# EAGLE design isp_hvp_shield (EAGLE 7.2.0)
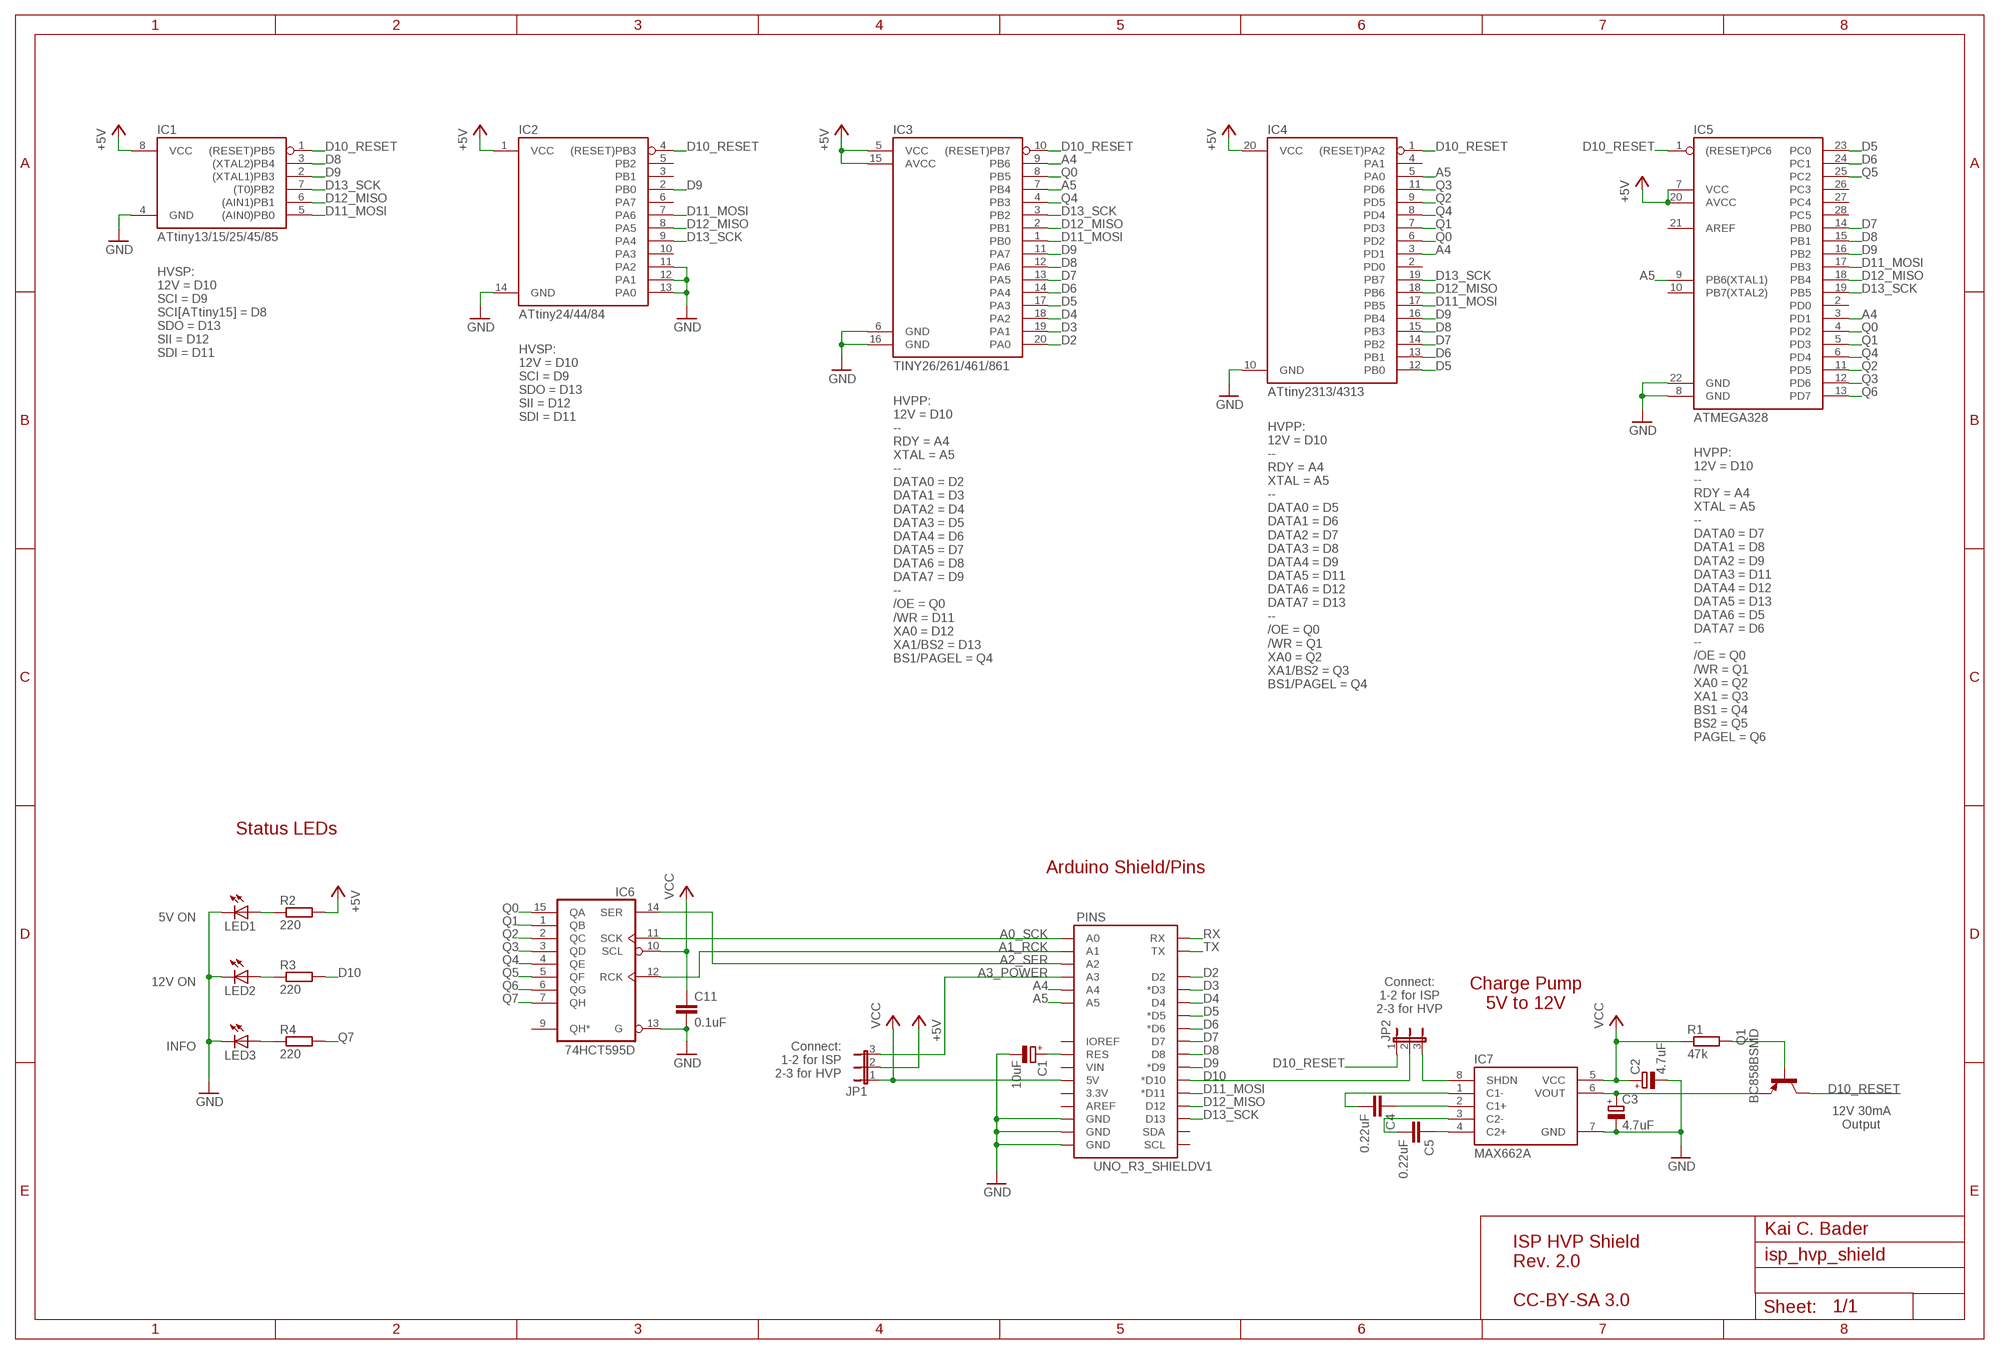
[diagram p0: schematic, sheet 1]

## Parts
C1  10uF  CPOL-EUE2-5  [E2-5]
C2  4.7uF  CPOL-EUE2-5  [E2-5]
C3  4.7uF  CPOL-EUE2-5  [E2-5]
C4  0.22uF  C-EUC0805  [C0805]
C5  0.22uF  C-EUC0805  [C0805]
C11  0.1uF  C-EUC0805  [C0805]
IC1  ATtiny13/15/25/45/85  TINY85P  [DIL08]
IC2  ATtiny24/44/84  TINY84  [DIL14]
IC3  TINY26/261/461/861  TINY26  [DIL20]
IC4  ATtiny2313/4313  TINY2313  [DIL20]
IC5  ATMEGA328  [DIL28]
IC6  74HCT595D  [SO16]
IC7  MAX662A  [SO08]
JP1  JP2E  [JP2]
JP2  JP2E  [JP2]
LED1  LEDCHIPLED_0805  [CHIPLED_0805]
LED2  LEDCHIPLED_0805  [CHIPLED_0805]
LED3  LEDCHIPLED_0805  [CHIPLED_0805]
PINS  UNO_R3_SHIELDV1  [UNO_R3_SHIELD]
Q1  BC858BSMD  [SOT23-BEC]
R1  47k  R-EU_R0805  [R0805]
R2  220  R-EU_R0805  [R0805]
R3  220  R-EU_R0805  [R0805]
R4  220  R-EU_R0805  [R0805]

## Nets
220: LED2.A R3.1
+5V: IC1.8(VCC) IC2.1(VCC) IC3.5(VCC) IC3.15(AVCC) IC4.20(VCC) IC5.7(VCC) IC5.20(AVCC) JP1.2 R2.2
A0_SCK: IC6.11(SCK) PINS.A0
A1_RCK: IC6.12(RCK) PINS.A1
A2_SER: IC6.14(SER) PINS.A2
A3_POWER: JP1.3 PINS.A3
A4: IC3.9(PB6) IC4.3(PD1) IC5.3(PD1) PINS.A4
A5: IC3.7(PB4) IC4.5(PA0) IC5.9(PB6(XTAL1)) PINS.A5
D2: IC3.20(PA0) PINS.D2
D3: IC3.19(PA1) PINS.D3(*D3)
D4: IC3.18(PA2) PINS.D4
D5: IC3.17(PA3) IC4.12(PB0) IC5.23(PC0) PINS.D5(*D5)
D6: IC3.14(PA4) IC4.13(PB1) IC5.24(PC1) PINS.D6(*D6)
D7: IC3.13(PA5) IC4.14(PB2) IC5.14(PB0) PINS.D7
D8: IC1.3((XTAL2)PB4) IC3.12(PA6) IC4.15(PB3) IC5.15(PB1) PINS.D8
D9: IC1.2((XTAL1)PB3) IC2.2(PB0) IC3.11(PA7) IC4.16(PB4) IC5.16(PB2) PINS.D9(*D9)
D10: JP2.2 PINS.D10(*D10) R3.2
D10_RESET: IC1.1((RESET)PB5) IC2.4((RESET)PB3) IC3.10((RESET)PB7) IC4.1((RESET)PA2) IC5.1((RESET)PC6) JP2.1 Q1.C
D11_MOSI: IC1.5((AIN0)PB0) IC2.7(PA6) IC3.1(PB0) IC4.17(PB5) IC5.17(PB3) PINS.D11(*D11)
D12_MISO: IC1.6((AIN1)PB1) IC2.8(PA5) IC3.2(PB1) IC4.18(PB6) IC5.18(PB4) PINS.D12
D13_SCK: IC1.7((T0)PB2) IC2.9(PA4) IC3.3(PB2) IC4.19(PB7) IC5.19(PB5) PINS.D13
GND: C1.- C2.- C3.- C11.2 IC1.4(GND) IC2.11(PA2) IC2.12(PA1) IC2.13(PA0) IC2.14(GND) IC3.6(GND) IC3.16(GND) IC4.10(GND) IC5.8(GND) IC5.22(GND) IC6.13(G) IC7.7(GND) LED1.C LED2.C LED3.C PINS.GND@0(GND) PINS.GND@1(GND) PINS.GND@2(GND)
N$1: IC7.8(SHDN) JP2.3
N$2: C1.+ PINS.RES
N$3: Q1.B R1.2
N$4: C5.1 IC7.4(C2+)
N$5: C5.2 IC7.3(C2-)
N$6: C4.1 IC7.2(C1+)
N$7: C4.2 IC7.1(C1-)
N$8: LED1.A R2.1
N$10: LED3.A R4.1
Q0: IC3.8(PB5) IC4.6(PD2) IC5.4(PD2) IC6.15(QA)
Q1: IC4.7(PD3) IC5.5(PD3) IC6.1(QB)
Q2: IC4.9(PD5) IC5.11(PD5) IC6.2(QC)
Q3: IC4.11(PD6) IC5.12(PD6) IC6.3(QD)
Q4: IC3.4(PB3) IC4.8(PD4) IC5.6(PD4) IC6.4(QE)
Q5: IC5.25(PC2) IC6.5(QF)
Q6: IC5.13(PD7) IC6.6(QG)
Q7: IC6.7(QH) R4.2
RX: PINS.RX
TX: PINS.TX
VCC: C2.+ C11.1 IC6.10(SCL) IC7.5(VCC) JP1.1 PINS.5V R1.1
VOUT: C3.+ IC7.6(VOUT) Q1.E
Unconnected: IC2.3(PB1) IC2.5(PB2) IC2.6(PA7) IC2.10(PA3) IC4.2(PD0) IC4.4(PA1) IC5.2(PD0) IC5.10(PB7(XTAL2)) IC5.26(PC3) IC5.27(PC4) IC5.28(PC5) IC6.9(QH*) PINS.3.3V PINS.AREF PINS.IOREF PINS.SCL PINS.SDA PINS.VIN

## Notes on the sheet
- HVSP:
  12V = D10
  SCI = D9
  SCI[ATtiny15] = D8
  SDO = D13
  SII = D12
  SDI = D11
- HVSP:
  12V = D10
  SCI = D9
  SDO = D13
  SII = D12
  SDI = D11
- HVPP:
  12V = D10
  --
  RDY = A4
  XTAL = A5
  --
  DATA0 = D2
  DATA1 = D3
  DATA2 = D4
  DATA3 = D5
  DATA4 = D6
  DATA5 = D7
  DATA6 = D8
  DATA7 = D9
  --
  /OE = Q0
  /WR = D11
  XA0 = D12
  XA1/BS2 = D13
  BS1/PAGEL = Q4
- HVPP:
  12V = D10
  --
  RDY = A4
  XTAL = A5
  --
  DATA0 = D5
  DATA1 = D6
  DATA2 = D7
  DATA3 = D8
  DATA4 = D9
  DATA5 = D11
  DATA6 = D12
  DATA7 = D13
  --
  /OE = Q0
  /WR = Q1
  XA0 = Q2
  XA1/BS2 = Q3
  BS1/PAGEL = Q4
- HVPP:
  12V = D10
  --
  RDY = A4
  XTAL = A5
  --
  DATA0 = D7
  DATA1 = D8
  DATA2 = D9
  DATA3 = D11
  DATA4 = D12
  DATA5 = D13
  DATA6 = D5
  DATA7 = D6
  --
  /OE = Q0
  /WR = Q1
  XA0 = Q2
  XA1 = Q3
  BS1 = Q4
  BS2 = Q5
  PAGEL = Q6
- Status LEDs
- Arduino Shield/Pins
- 5V ON
- 12V ON
- Connect:
  1-2 for ISP
  2-3 for HVP
- Charge Pump
  5V to 12V
- INFO
- Connect:
  1-2 for ISP
  2-3 for HVP
- 12V 30mA
  Output
- Kai C. Bader
- ISP HVP Shield
  Rev. 2.0
  
  CC-BY-SA 3.0

## Power pins joined to a net without a drawn wire
AREF: IC5.21(AREF)
GND: IC6.8(GND)
VCC: IC6.16(VCC)

## Library data of the parts
C1-C3 = rcl:CPOL-EU: POLARIZED CAPACITOR, European symbol
C4 C5 C11 = rcl:C-EU: CAPACITOR, European symbol
IC1 = kaibader:TINY85: ATtiny85 8-bit AVR Microcontroller, 8KB Flash Pin-compatible to ATtiny25, ATtiny45; OC_FARNELL: unknown; OC_NEWARK: unknown
IC2 = kaibader:TINY84: ATtiny84 8-bit AVR Microcontroller, 8KB Flash Pin-compatible to ATtiny24, ATtiny44
IC3 = kaibader:TINY26: ATtiny26
IC4 = kaibader:TINY2313: ATtiny2313 8-bit AVR Microcontroller, 2KB Flash Pin-compatible to ATtiny4313
IC5 = kaibader:ATMEGA328: ATmega328P
IC6 = 74xx-eu:74*595: 8-bit SHIFT REGISTER, output latch
IC7 = kaibader:MAX662A: MAX662A / ST662A MAXIM +12V, 30mA Flash Memory Programming Supply
JP1 JP2 = jumper:JP2E: JUMPER
LED1-LED3 = led:LED: LED OSRAM: - CHIPLED LG R971, LG N971, LY N971, LG Q971, LY Q971, LO R971, LY R971 LH N974, LH R974 LS Q976, LO Q976, LY Q976 LO Q996 - Hyper CHIPLED LW Q18S LB Q993, LB Q99A, LB R99A - SideLED LS A670, LO A670, LY A670, LG A670, LP A670 LB A673, LV A673, LT A673, LW A673 LH A674 LY A675 LS A676, LA A676, LO A676, LY A676, LW A676 LS A679, LY A679, LG A679 - Hyper Micro SIDELED® LS Y876, LA Y876, LO Y876, LY Y876 LT Y87S - SmartLED LW L88C, LW L88S LB L89C, LB L89S, LG L890 LS L89K, LO L89K, LY L89K LS L896, LA L896, LO L896, LY L896 - TOPLED LS T670, LO T670, LY T670, LG T670, LP T670 LSG T670, LSP T670, LSY T670, LOP T670, LYG T670 LG T671, LOG T671, LSG T671 LB T673, LV T673, LT T673, LW T673 LH T674 LS T676, LA T676, LO T676, LY T676, LB T676, LH T676, LSB T676, LW T676 LB T67C, LV T67C, LT T67C, LS T67K, LO T67K, LY T67K, LW E67C LS E67B, LA E67B, LO E67B, LY E67B, LB E67C, LV E67C, LT E67C LW T67C LS T679, LY T679, LG T679 LS T770, LO T770, LY T770, LG T770, LP T770 LB T773, LV T773, LT T773, LW T773 LH T774 LS E675, LA E675, LY E675, LS T675 LS T776, LA T776, LO T776, LY T776, LB T776 LHGB T686 LT T68C, LB T68C - Hyper Mini TOPLED® LB M676 - Mini TOPLED Santana® LG M470 LS M47K, LO M47K, LY M47K Source: http://www.osram.convergy.de LUXEON: - LUMILED® LXK2-PW12-R00, LXK2-PW12-S00, LXK2-PW14-U00, LXK2-PW14-V00 LXK2-PM12-R00, LXK2-PM12-S00, LXK2-PM14-U00 LXK2-PE12-Q00, LXK2-PE12-R00, LXK2-PE12-S00, LXK2-PE14-T00, LXK2-PE14-U00 LXK2-PB12-K00, LXK2-PB12-L00, LXK2-PB12-M00, LXK2-PB14-N00, LXK2-PB14-P00, LXK2-PB14-Q00 LXK2-PR12-L00, LXK2-PR12-M00, LXK2-PR14-Q00, LXK2-PR14-R00 LXK2-PD12-Q00, LXK2-PD12-R00, LXK2-PD12-S00 LXK2-PH12-R00, LXK2-PH12-S00 LXK2-PL12-P00, LXK2-PL12-Q00, LXK2-PL12-R00 Source: www.luxeon.com KINGBRIGHT: KA-3528ASYC Source: www.kingbright.com
PINS = kaibader:UNO_R3_SHIELD: Shield form compatible with the Arduino Uno R3.
Q1 = transistor-pnp:BC858*: PNP Transistror
R1-R4 = rcl:R-EU_: RESISTOR, European symbol

## Board
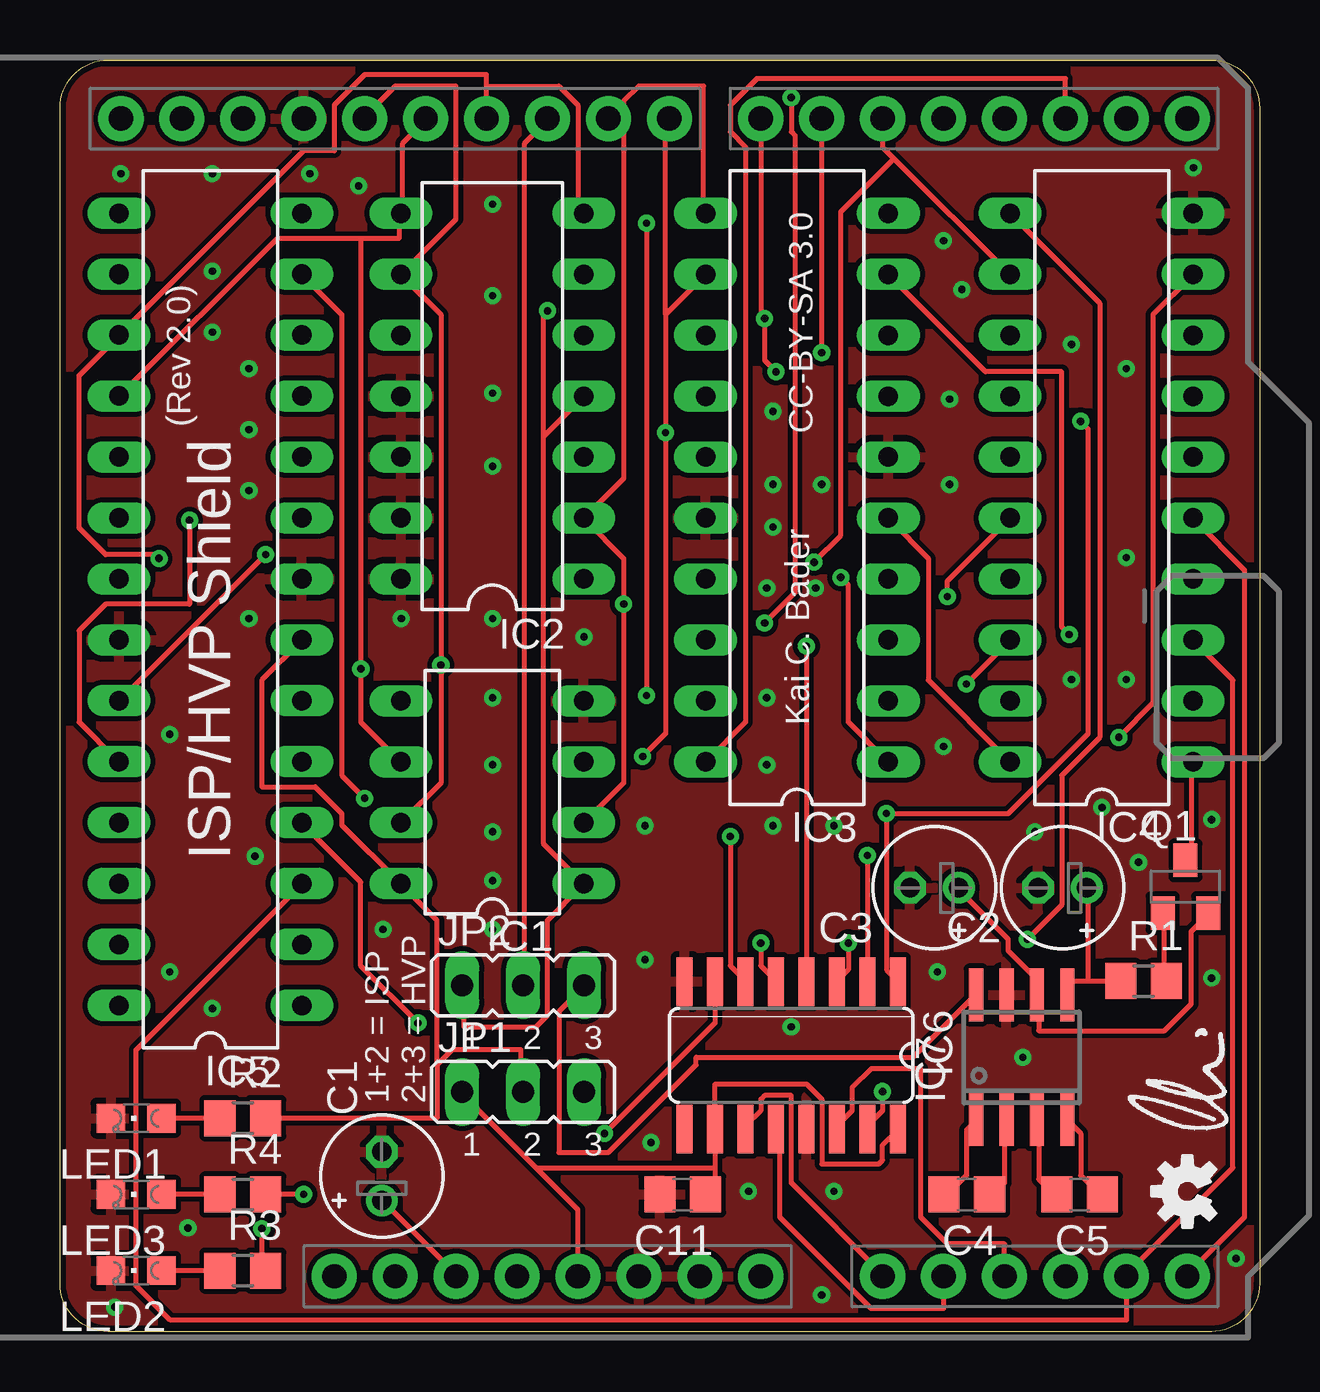
[diagram p1: board, top side]
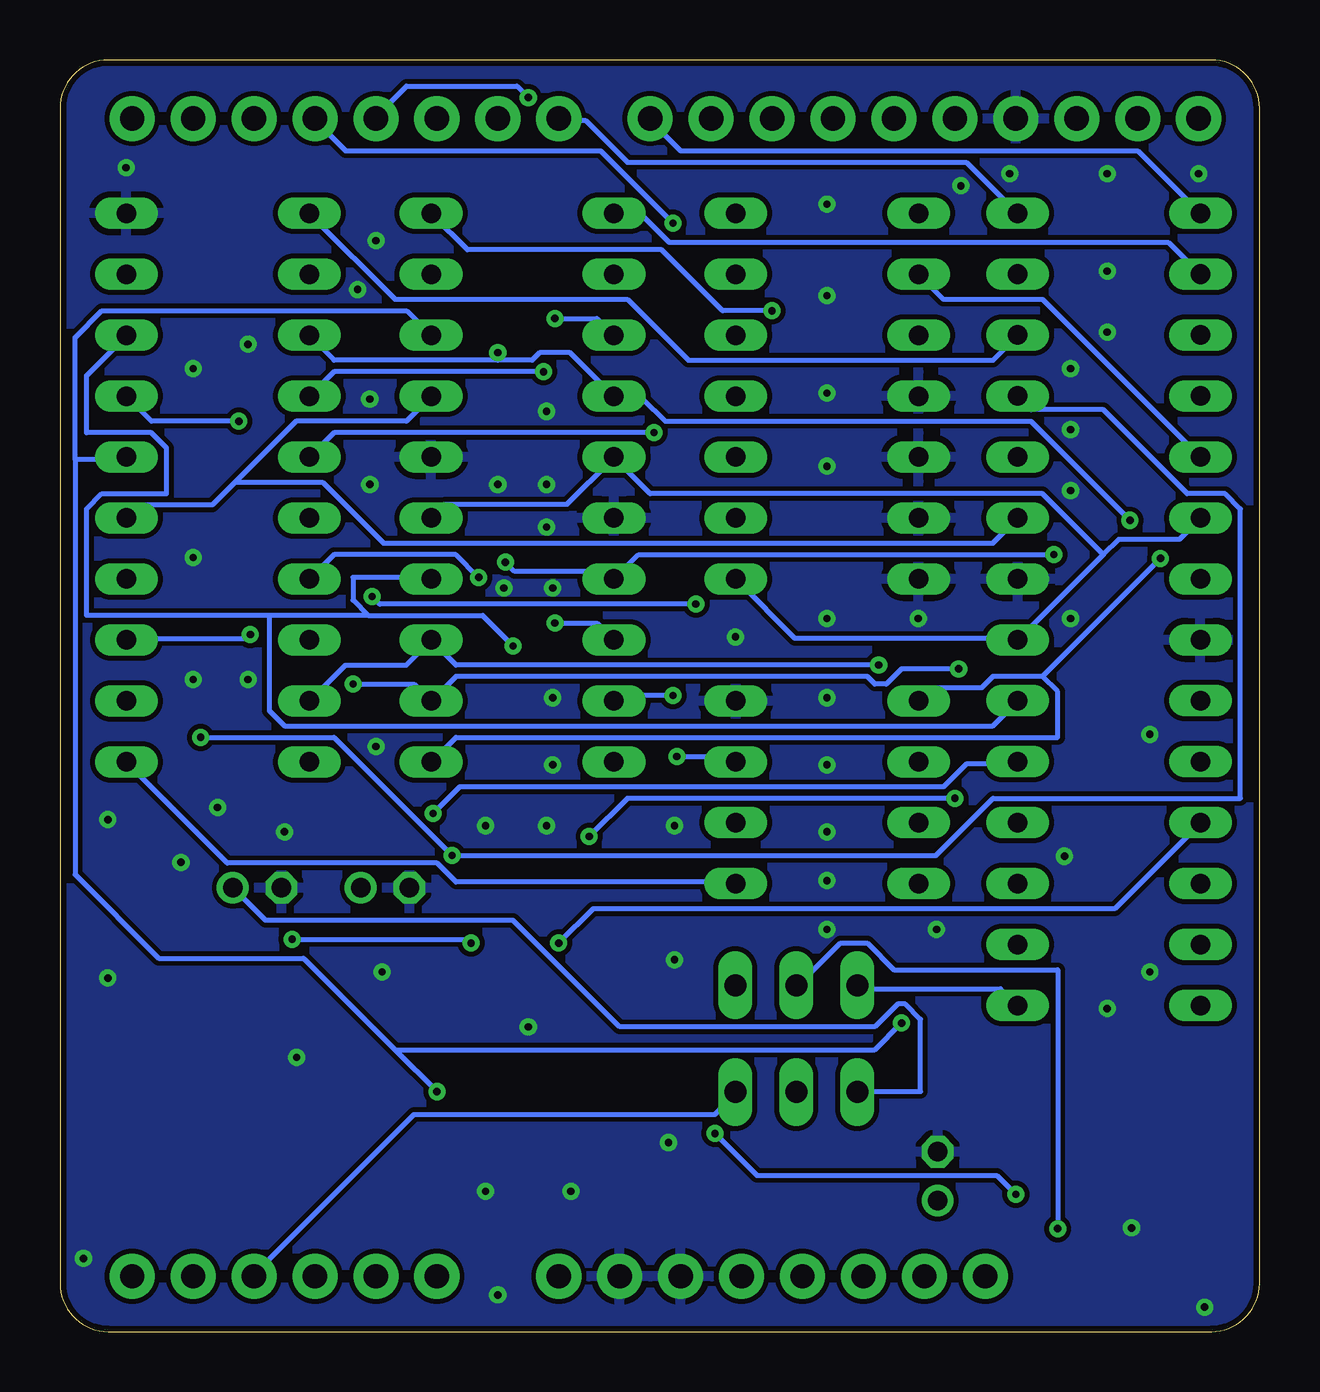
[diagram p2: board, bottom side, seen from below]

Size 50 x 53 mm. Coordinates in mm from the lower left corner, seen from the top.
Outline: 0,2 0,51 arc-90 2,53 48,53 arc-90 50,51 50,2 arc-90 48,0 2,0 arc-90 0,2
Copper layers (1*16): Top 0.035mm / dielectric 1.5mm / Bottom 0.035mm
Design rules "ITEADstudio_DRC *": minimum track width 8mil, minimum drill 12mil, track to track 8mil, track to pad 8mil, pad to pad 8mil, via to via 8mil, smd to smd 0mil, copper to edge 10mil, drill to drill 10mil, minimum pad ring 10mil, minimum via ring 8mil, stop-mask expansion 2mil, vias tented up to drill 100mil, thermal gap 10mil

### Footprints (pad centres in the part's own frame; a part is rotated, then mirrored left to right if it is on the bottom)
E2-5 = drill 0.813 pad 1.27: + -1.016,0 | drill 0.813 pad 1.27 octagon: - 1.016,0
C0805 = smd 1.3 x 1.5: 1 -0.95,0; 2 0.95,0
DIL08 = drill 0.813 long: 1 -3.81,-3.81; 2 -1.27,-3.81; 3 1.27,-3.81; 4 3.81,-3.81; 5 3.81,3.81; 6 1.27,3.81; 7 -1.27,3.81; 8 -3.81,3.81
DIL14 = drill 0.813 long: 1 -7.62,-3.81; 2 -5.08,-3.81; 3 -2.54,-3.81; 4 0,-3.81; 5 2.54,-3.81; 6 5.08,-3.81; 7 7.62,-3.81; 8 7.62,3.81; 9 5.08,3.81; 10 2.54,3.81; 11 0,3.81; 12 -2.54,3.81; 13 -5.08,3.81; 14 -7.62,3.81
DIL20 = drill 0.813 long: 1 -11.43,-3.81; 2 -8.89,-3.81; 3 -6.35,-3.81; 4 -3.81,-3.81; 5 -1.27,-3.81; 6 1.27,-3.81; 7 3.81,-3.81; 8 6.35,-3.81; 9 8.89,-3.81; 10 11.43,-3.81; 11 11.43,3.81; 12 8.89,3.81; 13 6.35,3.81; 14 3.81,3.81; 15 1.27,3.81; 16 -1.27,3.81; 17 -3.81,3.81; 18 -6.35,3.81; 19 -8.89,3.81; 20 -11.43,3.81
DIL28 = drill 0.813 long: 1 -11.43,-3.81; 2 -8.89,-3.81; 3 -6.35,-3.81; 4 -3.81,-3.81; 5 -1.27,-3.81; 6 1.27,-3.81; 7 3.81,-3.81; 8 6.35,-3.81; 9 8.89,-3.81; 10 11.43,-3.81; 11 13.97,-3.81; 12 16.51,-3.81; 13 19.05,-3.81; 14 21.59,-3.81; 15 21.59,3.81; 16 19.05,3.81; 17 16.51,3.81; 18 13.97,3.81; 19 11.43,3.81; 20 8.89,3.81; 21 6.35,3.81; 22 3.81,3.81; 23 1.27,3.81; 24 -1.27,3.81; 25 -3.81,3.81; 26 -6.35,3.81; 27 -8.89,3.81; 28 -11.43,3.81
SO16 = smd 0.66 x 2.032: 1 -4.445,-3.073; 2 -3.175,-3.073; 3 -1.905,-3.073; 4 -0.635,-3.073; 5 0.635,-3.073; 6 1.905,-3.073; 7 3.175,-3.073; 8 4.445,-3.073; 9 4.445,3.073; 10 3.175,3.073; 11 1.905,3.073; 12 0.635,3.073; 13 -0.635,3.073; 14 -1.905,3.073; 15 -3.175,3.073; 16 -4.445,3.073
SO08 = smd 0.6 x 2.2: 1 -1.905,-2.6; 2 -0.635,-2.6; 3 0.635,-2.6; 4 1.905,-2.6; 5 1.905,2.6; 6 0.635,2.6; 7 -0.635,2.6; 8 -1.905,2.6
JP2 = drill 0.914 long: 1 -2.54,0; 2 0,0; 3 2.54,0
CHIPLED_0805 = smd 1.2 x 1.2: A 0,-1.05; C 0,1.05
UNO_R3_SHIELD = drill 1.016 pad 1.88: 3.3V 50.8,26.67; 5V 50.8,29.21; A0 50.8,41.91; A1 50.8,44.45; A2 50.8,46.99; A3 50.8,49.53; A4 50.8,52.07; A5 50.8,54.61; AREF 2.54,15.24; D2 2.54,49.53; D3 2.54,46.99; D4 2.54,44.45; D5 2.54,41.91; D6 2.54,39.37; D7 2.54,36.83; D8 2.54,33.02; D9 2.54,30.48; D10 2.54,27.94; D11 2.54,25.4; D12 2.54,22.86; D13 2.54,20.32; GND@0 50.8,31.75; GND@1 50.8,34.29; GND@2 2.54,17.78; IOREF 50.8,21.59; NC 50.8,19.05; RES 50.8,24.13; RX 2.54,54.61; SCL 2.54,10.16; SDA 2.54,12.7; TX 2.54,52.07; VIN 50.8,36.83
SOT23-BEC = smd 1 x 1.4: B -0.95,-1.1; C 0,1.1; E 0.95,-1.1
R0805 = smd 1.3 x 1.5: 1 -0.95,0; 2 0.95,0

### Placement (x,y rotation side)
C1  13.41,6.48 90 top
C2  41.78,18.5 180 top
C3  36.45,18.5 180 top
C4  37.8,5.71 180 top
C5  42.5,5.71 180 top
C11  25.95,5.71 180 top
IC1  18.02,22.48 90 top
IC2  18.02,38.99 90 top
IC3  30.72,35.18 90 top
IC4  43.42,35.18 90 top
IC5  6.27,25.02 90 top
IC6  30.48,11.51 180 top
IC7  40.09,11.43 0 top
JP1  19.3,9.99 0 top
JP2  19.3,14.43 0 top
LED1  3.17,8.89 90 top
LED2  3.17,2.54 90 top
LED3  3.17,5.71 90 top
PINS  -7.62,53.1 270 top
Q1  46.91,18.54 0 top
R1  45.16,14.61 0 top
R2  7.62,8.89 0 top
R3  7.62,2.54 0 top
R4  7.62,5.71 0 top
U$1  [OSHW-LOGO-S]  46.99,5.84 90 top
U$3  [KAI-LOGO-M]  48.9,8.26 90 top

### Tracks (layer width: path | path; a pad name or v marks a point on that pad's centre or on a via)
220
  Top 0.203: R3.1 LED2.A
+5V
  Top 0.203: IC4.20 39.53,23.81 36.2,27.15 36.2,32.23 34.61,33.81 IC3.5 | R2.2 15.72,8.89 15.72,11.11 | 15.72,11.11 16.35,11.75 19.21,11.75 19.21,10 JP1.2 | 15.72,11.11 15.72,17.14 14.29,18.57 IC1.8 14.13,18.73 11.75,21.11 11.75,21.59 10.64,22.7 8.41,22.7 8.41,27.15 10,28.73 IC5.7
  Bottom 0.203: IC3.5 33.94,34.48 28.86,34.48 26.99,36.35 IC3.15 26.83,36.35 25.4,34.92 9.05,34.92 6.51,32.38 | 6.51,32.38 5.87,33.02 3.33,33.02 2.54,33.81 IC5.20 | 6.51,32.38 10,28.89 IC5.7 10.16,28.89 19.37,28.89 21.75,31.27 IC2.1
A0_SCK
  Top 0.203: IC6.11 28.57,8.57 29.21,9.21 29.21,9.68 29.37,9.84 30.48,9.84 30.48,6.19 34.29,2.38 PINS.A0
A1_RCK
  Top 0.203: PINS.A1 36.83,0.95 33.81,0.95 30,4.76 30,8.26 29.84,8.41 IC6.12
A2_SER
  Top 0.203: PINS.A2 39.37,3.65 36.99,3.65 35.88,4.76 35.88,10.95 33.81,10.95 33.02,10.16 33.02,9.21 32.38,8.57 IC6.14
A3_POWER
  Bottom 0.203: JP1.3 21.91,9.84 22.7,9.05 35.24,9.05 41.91,2.38 PINS.A3
A4  (via drill 0.3)
  Top 0.203: IC5.3 10,18.57 3.17,11.75 3.17,1.91 4.6,0.48 44.45,0.48 PINS.A4 44.45,2.38 48.9,6.83 48.9,27.15 47.31,28.73 IC4.3 | v42.07,29.05 41.75,29.37 41.75,40.01 38.58,40.01 34.61,43.97 IC3.9
  Bottom 0.203: v42.07,29.05 42.23,28.89 47.15,28.89 IC4.3
A5
  Top 0.203: PINS.A5 46.99,2.38 49.37,4.76 49.37,31.75 47.31,33.81 IC4.5
  Bottom 0.203: 42.7,35.4 40.16,37.94 35.56,37.94 34.61,38.89 IC3.7 | 42.7,35.4 43.66,34.45 46.67,34.45 47.15,33.97 IC4.5 | 42.7,35.4 39.05,35.4 36.51,32.86 11.11,32.86 10.16,33.81 IC5.9
D2
  Top 0.203: PINS.D2 41.91,52.23 29.05,52.23 27.94,51.12 27.94,50.01 28.57,49.37 28.57,25.4 26.99,23.81 IC3.20
D3  (via drill 0.3)
  Top 0.203: v24.45,46.2 v24.45,26.51
  Bottom 0.203: v24.45,26.51 26.67,26.51 26.83,26.35 IC3.19 | v24.45,46.2 27.46,49.21 38.1,49.21 39.37,50.48 PINS.D3
D4  (via drill 0.3)
  Top 0.203: v29.37,29.53 30.64,30.8 30.64,49.85 30.48,50.01 v30.48,51.44
  Bottom 0.203: v29.37,29.53 27.62,29.53 26.99,28.89 IC3.18 | v30.48,51.44 30.96,51.91 35.56,51.91 36.83,50.64 PINS.D4
D5  (via drill 0.3)
  Top 0.203: 34.77,48.9 34.29,49.37 PINS.D5 | 34.77,48.9 39.53,44.13 IC4.12 | v8.57,32.38 2.54,26.35 IC5.23 | 34.77,48.9 32.54,46.67 32.54,33.18 v31.43,32.07
  Bottom 0.203: v8.57,32.38 25.88,32.38 26.83,31.43 IC3.17 26.99,31.69 31.05,31.69 v31.43,32.07
D6  (via drill 0.3)
  Top 0.203: v5.4,33.81 5.4,30.32 1.91,30.32 0.79,29.21 0.79,25.4 2.38,23.81 IC5.24 | v31.75,40.8 PINS.D6
  Bottom 0.203: v5.4,33.81 9.53,37.94 24.77,37.94 25.72,38.89 26.83,38.89 IC3.14 26.99,39.05 28.73,40.8 30,40.8 30.32,40.48 31.75,40.48 | 31.75,40.48 38.58,40.48 39.53,41.43 IC4.13 | 31.75,40.48 v31.75,40.8
D7  (via drill 0.3)
  Top 0.203: PINS.D7 29.21,42.39 v29.37,42.23 29.37,40.48 v29.84,40.01
  Bottom 0.203: IC5.14 10.16,46.67 12.22,48.74 26.35,48.74 28.1,50.48 29.21,50.48 PINS.D7 | v29.37,42.23 27.62,42.23 26.99,41.59 IC3.13 | v29.84,40.01 38.58,40.01 39.53,39.05 IC4.14
D8  (via drill 0.3)
  Top 0.203: v24.29,23.97 25.24,24.92 v25.24,37.47 25.24,42.39 | 25.24,42.39 26.83,43.97 IC3.12 | 25.24,42.39 25.24,50.32 25.4,50.48 PINS.D8
  Bottom 0.203: IC5.15 2.54,46.67 5.08,49.21 24.13,49.21 25.4,50.48 PINS.D8 | v24.29,23.97 22.07,23.97 21.91,23.81 IC1.3 | v25.24,37.47 38.58,37.47 39.53,36.51 IC4.15
D9  (via drill 0.3)
  Top 0.203: IC1.2 21.91,21.27 23.5,22.86 v23.5,30.32 23.5,32.23 21.91,33.81 IC2.2 21.91,33.97 23.5,35.56 23.5,51.28 | v36.99,30.64 36.99,31.27 39.53,33.81 IC4.16 | 23.5,51.28 24.13,51.91 26.83,51.91 26.83,46.67 IC3.11 | 23.5,51.28 22.86,50.64 PINS.D9
  Bottom 0.203: v36.99,30.64 36.67,30.32 v23.5,30.32 | IC5.16 2.54,44.13 3.81,45.4 24.61,45.4 25.72,46.51 26.83,46.51 IC3.11
D10  (via drill 0.3)
  Top 0.203: v8.41,4.29 8.41,2.54 R3.2 | PINS.D10 20.32,50.48 19.37,49.53 19.37,14.45 JP2.2
  Bottom 0.203: v8.41,4.29 8.41,15.08 15.24,15.08 16.35,16.19 17.46,16.19 19.21,14.45 JP2.2
D10_RESET  (via drill 0.3)
  Top 0.203: Q1.C 46.99,19.68 47.15,19.84 47.15,23.65 IC4.1 | JP2.1 16.83,14.29 16.83,12.7 19.84,12.7 20.32,13.18 20.32,17.14 21.75,18.57 IC1.1 21.75,18.73 20.16,20.32 20.16,37.31 | 20.16,37.31 21.75,38.89 IC2.4 | v20.32,42.55 20.16,42.39 20.16,37.31
  Bottom 0.203: IC5.1 10.16,13.65 10.79,14.29 16.67,14.29 JP2.1 | v20.32,42.55 22.38,42.55 24.92,45.09 33.02,45.09 34.45,46.51 IC3.10 | IC4.1 47.15,23.65 43.02,19.53 34.29,19.53 33.5,18.73 21.91,18.73 IC1.1
D11_MOSI  (via drill 0.3)
  Top 0.203: PINS.D11 17.78,51.91 | 17.78,51.91 17.78,52.39 12.7,52.39 11.43,51.12 11.43,49.21 10.16,49.21 2.54,41.59 IC5.17 2.38,41.43 0.79,39.85 0.79,33.5 1.91,32.38 4.13,32.38 v4.13,32.23 | 17.78,51.91 20.8,51.91 21.59,51.12 21.59,46.83 21.75,46.67 IC2.7 | v32.54,31.43 32.86,31.11 32.86,25.4 34.45,23.81 IC3.1
  Bottom 0.203: 9.05,27.3 11.11,27.3 11.59,26.83 13.65,26.83 14.13,26.35 IC1.5 | 9.05,27.3 8.41,26.67 8.41,24.77 33.5,24.77 34.45,23.81 IC3.1 | v32.54,31.43 33.5,32.38 38.58,32.38 39.53,31.43 IC4.17 | 9.05,27.3 v4.13,32.23
D12_MISO  (via drill 0.3)
  Top 0.203: v37.78,26.99 39.53,28.73 IC4.18 | 12.54,45.56 14.13,45.56 14.13,46.51 IC2.8 14.29,46.67 14.29,49.53 15.24,50.48 PINS.D12 | 12.54,45.56 9.05,45.56 2.54,39.05 IC5.18 | 12.54,45.56 v12.54,27.62 12.54,25.4 14.13,23.81 IC1.6
  Bottom 0.203: v37.78,26.99 35.24,26.99 34.61,26.35 IC3.2 34.45,26.35 33.5,27.3 16.35,27.3 16.03,26.99 15.56,26.99 14.92,27.62 v12.54,27.62
D13_SCK  (via drill 0.3)
  Top 0.203: IC1.7 14.29,21.27 15.88,22.86 v15.88,27.78 15.88,42.39 14.29,43.97 IC2.9 14.29,44.13 16.51,46.35 16.51,51.91 13.97,51.91 12.7,50.64 PINS.D13
  Bottom 0.203: IC4.19 39.53,26.35 38.1,27.78 35.56,27.78 34.61,28.73 IC3.3 34.45,28.73 33.5,27.78 v15.88,27.78 | IC5.19 2.54,36.51 9.05,43.02 13.18,43.02 14.13,43.97 IC2.9
GND  (via drill 0.3 pad 0.71)
  other vias: 2.54,48.26 6.35,48.26 4.57,24.89 14.22,29.72 18.03,29.72 18.03,39.12 18.03,43.18 18.03,46.99 12.45,47.75 10.41,48.26 6.35,44.2 6.35,41.66 7.87,40.13 7.87,37.59 7.87,35.05 7.87,29.72 21.84,28.96 31.75,35.31 29.72,35.31 37.08,35.31 37.08,38.86 36.83,24.38 18.03,26.42 18.03,23.62 18.03,20.83 18.03,18.8 18.03,16.76 24.38,15.49 24.38,21.08 29.72,21.08 32.26,21.08 40.64,20.83 8.13,19.81 4.57,14.99 6.35,13.46 13.46,16.76 5.33,4.32 30.48,12.7 36.58,14.99 40.13,11.43 43.43,21.84 49.02,3.05 31.75,1.52 2.29,1.02 32.26,5.84 28.7,5.84 24.64,7.87 44.96,19.56 48.01,21.34 42.16,27.18 44.45,27.18 36.83,45.47 44.45,40.13 44.45,32.26 37.59,43.43 42.16,41.15 29.46,23.62 29.46,26.42 18.03,36.07 47.24,48.51 29.46,30.99 31.5,30.99 29.72,33.53 29.72,38.35 48.01,14.73
  pour Bottom: 50,0 0,0 0,53 50,53
  pour Top: 0,53 50,53 50,0 0,0
N$1
  Top 0.203: IC7.8 38.1,13.97 35.56,11.43 26.51,11.43 26.51,11.11 22.86,7.46 20.8,7.46 20.8,13.34 21.75,14.29 JP2.3
N$2
  Top 0.203: C1.+ 13.49,5.4 16.51,2.38 PINS.RES
N$3
  Top 0.203: Q1.B 46.04,17.3 46.04,14.61 R1.2
N$4
  Top 0.203: C5.1 43.34,5.71 42.55,6.51 42.55,8.26 42.07,8.73 IC7.4
N$5
  Top 0.203: C5.2 41.43,5.71 40.8,6.35 40.8,8.73 IC7.3
N$6
  Top 0.203: C4.1 38.89,5.71 39.37,6.19 39.37,8.73 IC7.2
N$7
  Top 0.203: C4.2 36.99,5.71 37.78,6.51 37.78,8.41 38.1,8.73 IC7.1
N$8
  Top 0.203: R2.1 LED1.A
N$10
  Top 0.203: R4.1 LED3.A
Q0  (via drill 0.3)
  Top 0.203: v34.29,10 34.29,9.21 33.66,8.57 IC6.15 | v14.92,12.86 12.54,15.24 12.54,18.73 10.16,21.11 IC5.4
  Bottom 0.203: 36.04,11.75 39.85,15.56 45.88,15.56 49.37,19.05 49.37,36.35 | 36.04,11.75 v34.29,10 | 49.37,36.35 47.31,36.35 IC4.6 | v14.92,12.86 16.03,11.75 36.04,11.75 | 49.37,36.35 49.37,41.43 48.26,42.55 35.56,42.55 34.61,41.59 IC3.8
Q1  (via drill 0.3)
  Top 0.203: IC6.1 34.92,14.61 34.45,15.08 v34.45,21.59 39.53,21.59 42.86,24.92 42.86,37.62 v42.55,37.94
  Bottom 0.203: v34.45,21.59 33.34,22.7 13.18,22.7 12.22,23.65 10.16,23.65 IC5.5 | v42.55,37.94 46.2,37.94 47.15,38.89 IC4.7
Q2  (via drill 0.3)
  Top 0.203: v33.66,19.84 IC6.2 | v44.13,24.77 45.56,26.19 45.56,42.39 47.15,43.97 IC4.9
  Bottom 0.203: v44.13,24.77 38.58,24.77 v33.66,19.84 13.49,19.84 11.11,22.23 0.79,22.23 0.79,34.29 1.43,34.92 3.02,34.92 6.51,38.42 9.53,38.42 10,38.89 IC5.11
Q3  (via drill 0.3)
  Top 0.203: v32.86,16.19 32.86,15.08 32.38,14.61 IC6.3 | v40.32,16.35 41.75,17.78 41.75,23.18 43.34,24.77 43.34,42.86 39.69,46.51 IC4.11
  Bottom 0.203: v32.86,16.19 33.02,16.35 v40.32,16.35 | IC5.12 10.16,41.43 11.11,40.48 23.81,40.48 26.35,43.02 36.04,43.02 39.53,46.51 IC4.11
Q4  (via drill 0.3)
  Top 0.203: v31.11,28.57 IC6.4
  Bottom 0.203: v31.11,28.57 32.38,29.84 37.15,29.84 | 37.15,29.84 37.78,30.48 37.78,31.43 34.61,31.43 IC3.4 | 41.27,29.84 41.27,25.88 40.64,25.24 11.11,25.24 10.16,26.19 IC5.6 | 37.15,29.84 41.27,29.84 | 41.27,29.84 48.9,29.84 48.9,34.29 48.26,34.92 45.56,34.92 45.56,36.83 46.2,37.47 48.9,37.47 48.9,39.85 47.31,41.43 IC4.8
Q5  (via drill 0.3)
  Top 0.203: v29.21,16.19 29.21,15.24 29.84,14.61 IC6.5
  Bottom 0.203: v29.21,16.19 27.78,17.62 6.03,17.62 2.54,21.11 IC5.25
Q6  (via drill 0.3)
  Top 0.203: v27.94,20.64 27.94,15.24 28.57,14.61 IC6.6 | v12.7,22.23 11.75,23.18 11.75,42.39 10.16,43.97 IC5.13
  Bottom 0.203: v27.94,20.64 26.35,22.23 v12.7,22.23
Q7  (via drill 0.3)
  Top 0.203: v10.16,5.71 R4.2 | v22.7,8.26 27.3,12.86 IC6.7
  Bottom 0.203: v10.16,5.71 10.95,6.51 20.95,6.51 v22.7,8.26
VCC
  Top 0.203: 27.3,6.83 IC6.10 27.3,10.32 31.11,10.32 31.75,9.68 31.75,6.99 34.13,6.99 34.29,7.14 34.29,7.78 34.92,8.41 IC6.16 | 27.3,6.83 27.3,6.03 26.99,5.71 C11.1 | 42.86,14.61 42.07,14.61 42.07,14.13 IC7.5 | 42.86,14.61 R1.1 | 42.86,14.61 42.86,18.41 C2.+ | 19.84,6.83 21.59,5.08 PINS.5V | 19.84,6.83 16.83,9.84 JP1.1 | 19.84,6.83 27.3,6.83
  Bottom 0.203: C2.+ 42.7,18.41 41.43,17.14 31.11,17.14 26.67,12.7 16.03,12.7 15.08,13.65 14.76,13.65 14.13,13.02 14.13,10 16.67,10 JP1.1
VOUT
  Top 0.203: Q1.E 47.78,17.3 47.15,16.67 47.15,13.65 46.04,12.54 40.8,12.54 40.8,13.97 IC7.6 40.64,14.13 40.64,14.76 39.53,15.88 39.53,16.35 37.47,18.41 C3.+

### Text on the board
tPlace: (Rev 2.0) | CC-BY-SA 3.0 | Kai C. Bader | ISP/HVP Shield | 1+2 = ISP / 2+3 = HVP